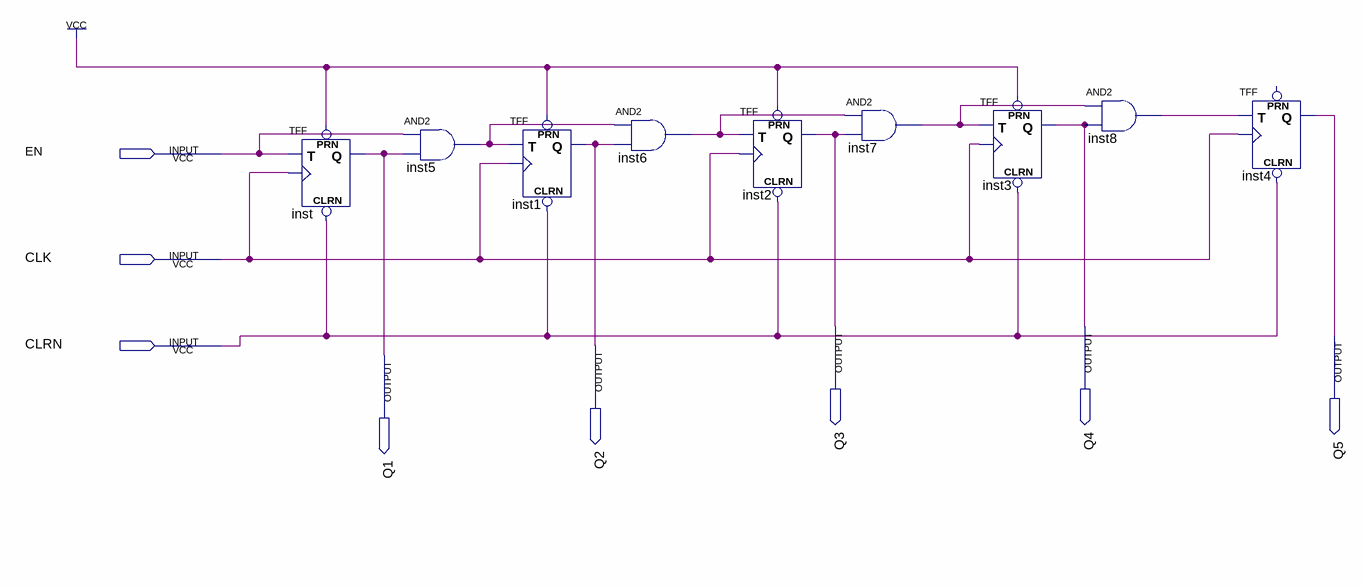
[diagram p0: schematic sheet]
// Quartus schematic lab10step2b.bdf as structural Verilog: 9 symbols, 8 pins
module lab10step2b (
  input  EN,
  input  CLK,
  input  CLRN,
  output Q3,
  output Q4,
  output Q5,
  output Q2,
  output Q1
);

  wire inst5_out, inst6_out, inst7_out, inst8_out;

  TFF inst (.PRN(1'b1), .CLRN(CLRN), .T(EN), .CLK(CLK), .Q(Q1));
  and inst5 (inst5_out, EN, Q1);
  TFF inst1 (.PRN(1'b1), .CLRN(CLRN), .T(inst5_out), .CLK(CLK), .Q(Q2));
  and inst6 (inst6_out, inst5_out, Q2);
  TFF inst2 (.PRN(1'b1), .CLRN(CLRN), .T(inst6_out), .CLK(CLK), .Q(Q3));
  and inst7 (inst7_out, inst6_out, Q3);
  TFF inst3 (.PRN(1'b1), .CLRN(CLRN), .T(inst7_out), .CLK(CLK), .Q(Q4));
  and inst8 (inst8_out, inst7_out, Q4);
  TFF inst4 (.CLRN(CLRN), .T(inst8_out), .CLK(CLK), .Q(Q5));  // open: PRN
endmodule
